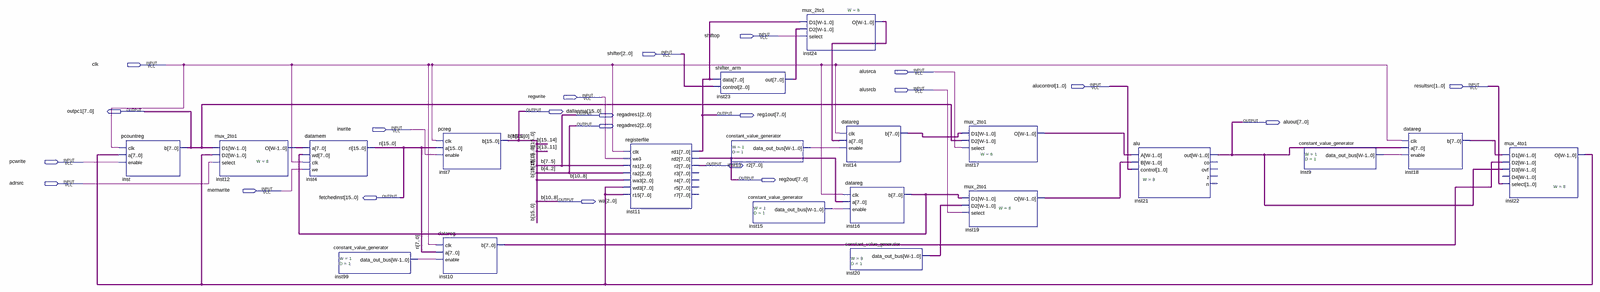
[diagram p0: schematic sheet, whole]
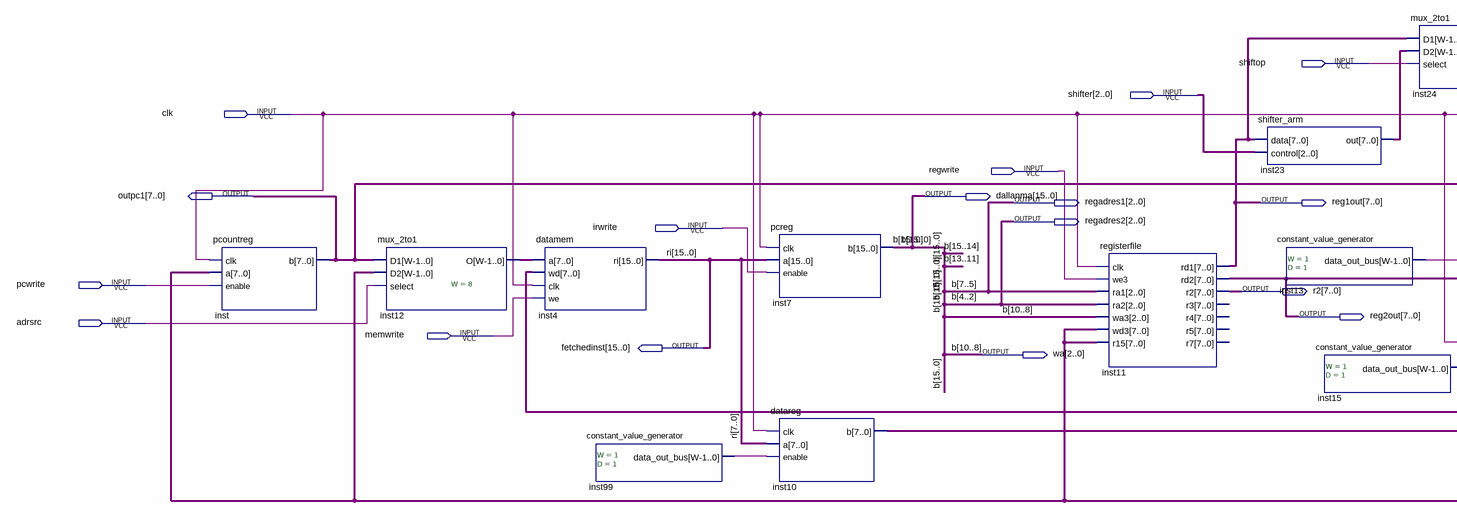
[diagram p1: schematic sheet, left part]
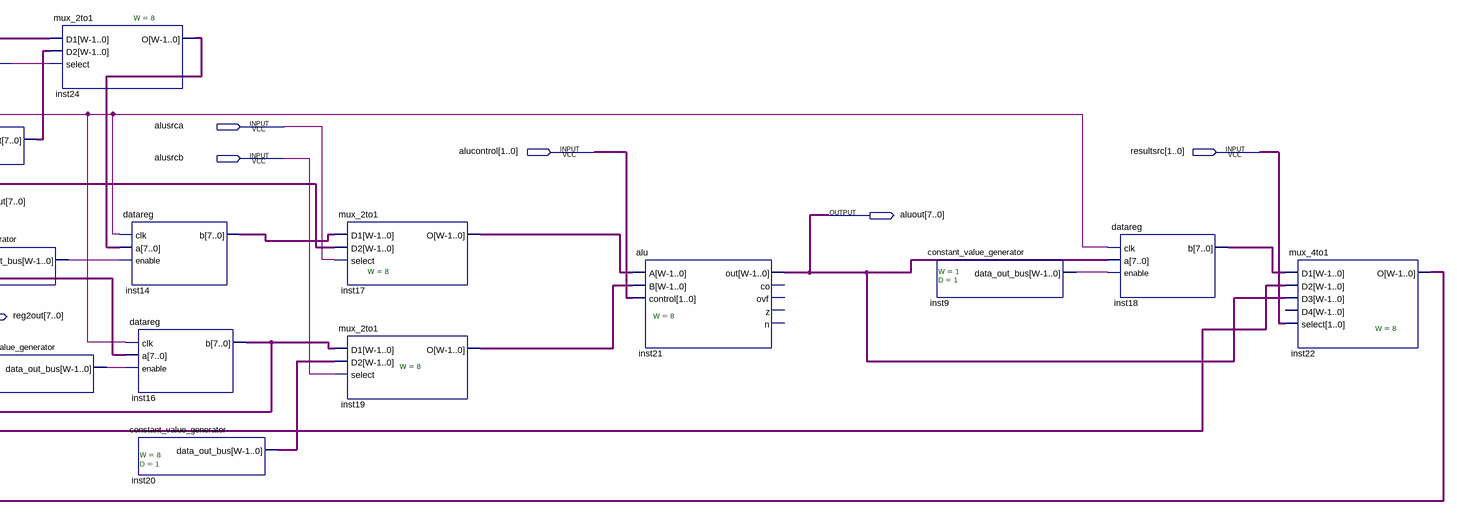
[diagram p2: schematic sheet, right part]
// Quartus schematic multicycle.bdf as structural Verilog: 20 symbols, 22 pins
module multicycle (
  input  shiftop,
  input  [2:0] shifter,
  input  clk,
  input  alusrca,
  input  [1:0] alucontrol,
  input  [1:0] resultsrc,
  input  alusrcb,
  input  regwrite,
  input  irwrite,
  input  pcwrite,
  input  adrsrc,
  input  memwrite,
  output [7:0] outpc1,
  output [15:0] dallanma,
  output [2:0] regadres1,
  output [7:0] reg1out,
  output [7:0] aluout,
  output [2:0] regadres2,
  output [7:0] r2,
  output [7:0] reg2out,
  output [15:0] fetchedinst,
  output [2:0] wa
);

  wire inst9_data_out_bus, inst13_data_out_bus, inst15_data_out_bus, inst99_data_out_bus;
  wire [7:0] inst10_b, inst12_o, inst14_b, inst16_b, inst17_o, inst18_b, inst19_o, inst20_data_out_bus,
       inst22_o, inst23_out, inst24_o;

  pcountreg inst (.clk(clk), .a(inst22_o), .enable(pcwrite), .b(outpc1));
  mux_2to1 #(.W(8)) inst12 (.D1(outpc1), .D2(inst22_o), .select(adrsrc), .O(inst12_o));
  datamem inst4 (.a(inst12_o), .wd(inst16_b), .clk(clk), .we(memwrite), .ri(fetchedinst));
  constant_value_generator #(.W(1), .D(1)) inst99 (.data_out_bus(inst99_data_out_bus));
  pcreg inst7 (.clk(clk), .a(fetchedinst), .enable(irwrite), .b(dallanma));
  datareg inst10 (.clk(clk), .a(fetchedinst[7:0]), .enable(inst99_data_out_bus), .b(inst10_b));
  registerfile inst11 (
    .clk(clk), .we3(regwrite), .ra1(dallanma[7:5]), .ra2(dallanma[4:2]), .wa3(dallanma[10:8]),
    .wd3(inst22_o), .r15(inst22_o), .rd1(reg1out), .rd2(reg2out), .r2(r2));  // open: r3, r4, r5, r7
  shifter_arm inst23 (.data(reg1out), .control(shifter), .out(inst23_out));
  constant_value_generator #(.W(1), .D(1)) inst13 (.data_out_bus(inst13_data_out_bus));
  constant_value_generator #(.W(1), .D(1)) inst15 (.data_out_bus(inst15_data_out_bus));
  mux_2to1 #(.W(8)) inst24 (.D1(reg1out), .D2(inst23_out), .select(shiftop), .O(inst24_o));
  datareg inst14 (.clk(clk), .a(inst24_o), .enable(inst13_data_out_bus), .b(inst14_b));
  datareg inst16 (.clk(clk), .a(reg2out), .enable(inst15_data_out_bus), .b(inst16_b));
  constant_value_generator #(.W(8), .D(1)) inst20 (.data_out_bus(inst20_data_out_bus));
  mux_2to1 #(.W(8)) inst17 (.D1(inst14_b), .D2(outpc1), .select(alusrca), .O(inst17_o));
  mux_2to1 #(.W(8)) inst19 (.D1(inst16_b), .D2(inst20_data_out_bus), .select(alusrcb), .O(inst19_o));
  alu #(.W(8)) inst21 (.A(inst17_o), .B(inst19_o), .control(alucontrol), .out(aluout));  // open: co, ovf, z, n
  constant_value_generator #(.W(1), .D(1)) inst9 (.data_out_bus(inst9_data_out_bus));
  datareg inst18 (.clk(clk), .a(aluout), .enable(inst9_data_out_bus), .b(inst18_b));
  mux_4to1 #(.W(8)) inst22 (.D1(inst18_b), .D2(inst10_b), .D3(aluout), .select(resultsrc), .O(inst22_o));  // open: D4

  assign regadres1 = dallanma[7:5];
  assign regadres2 = dallanma[4:2];
  assign wa = dallanma[10:8];

  // Other names for the same wires on the sheet: b[15:0] = dallanma; ri[15:0] = fetchedinst
endmodule
